# EAGLE board csa_cpu816-v2.0c (EAGLE 4.15)
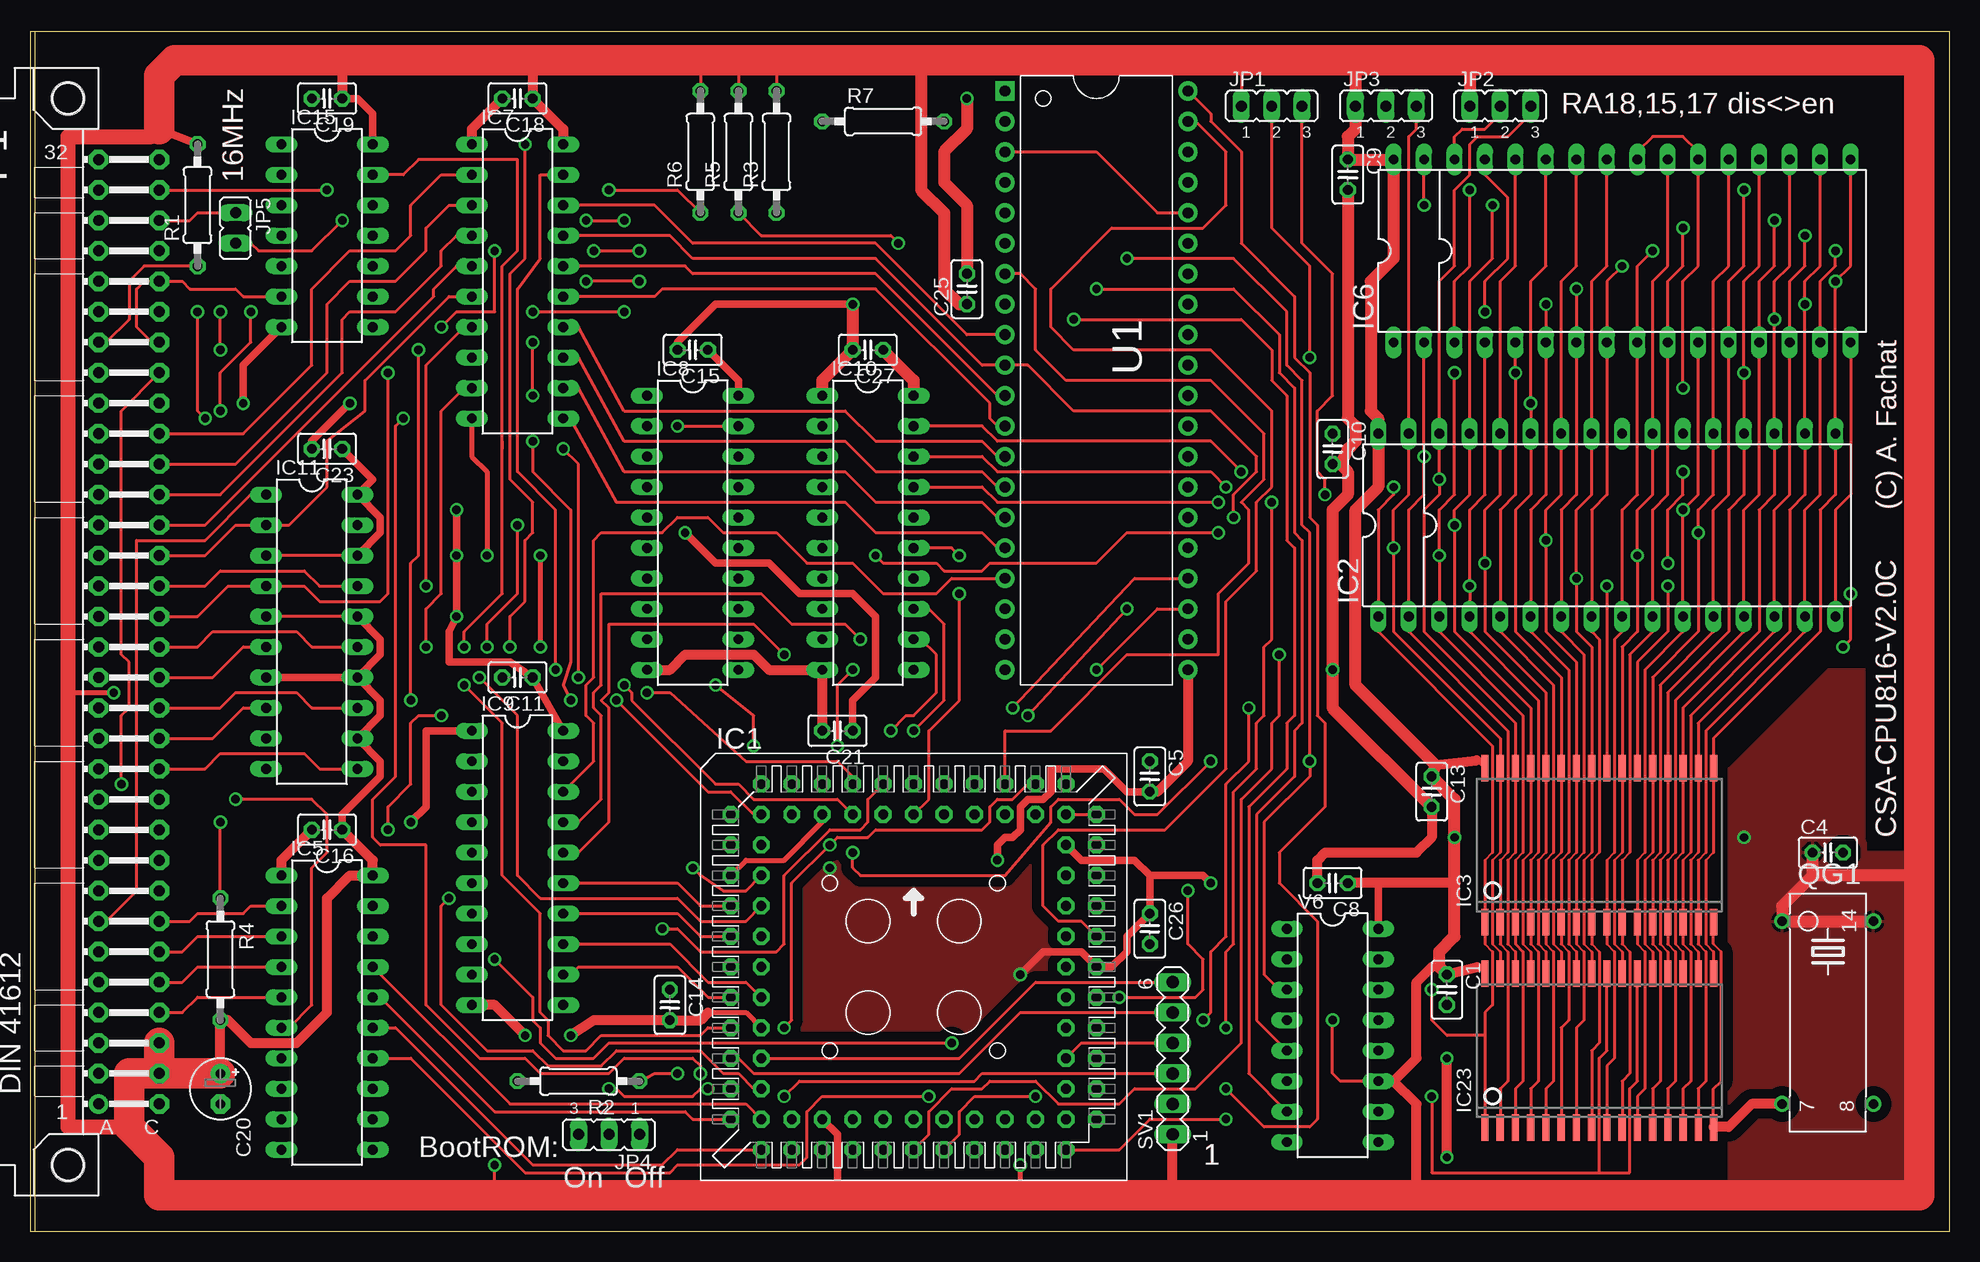
[diagram p2: board, top side]
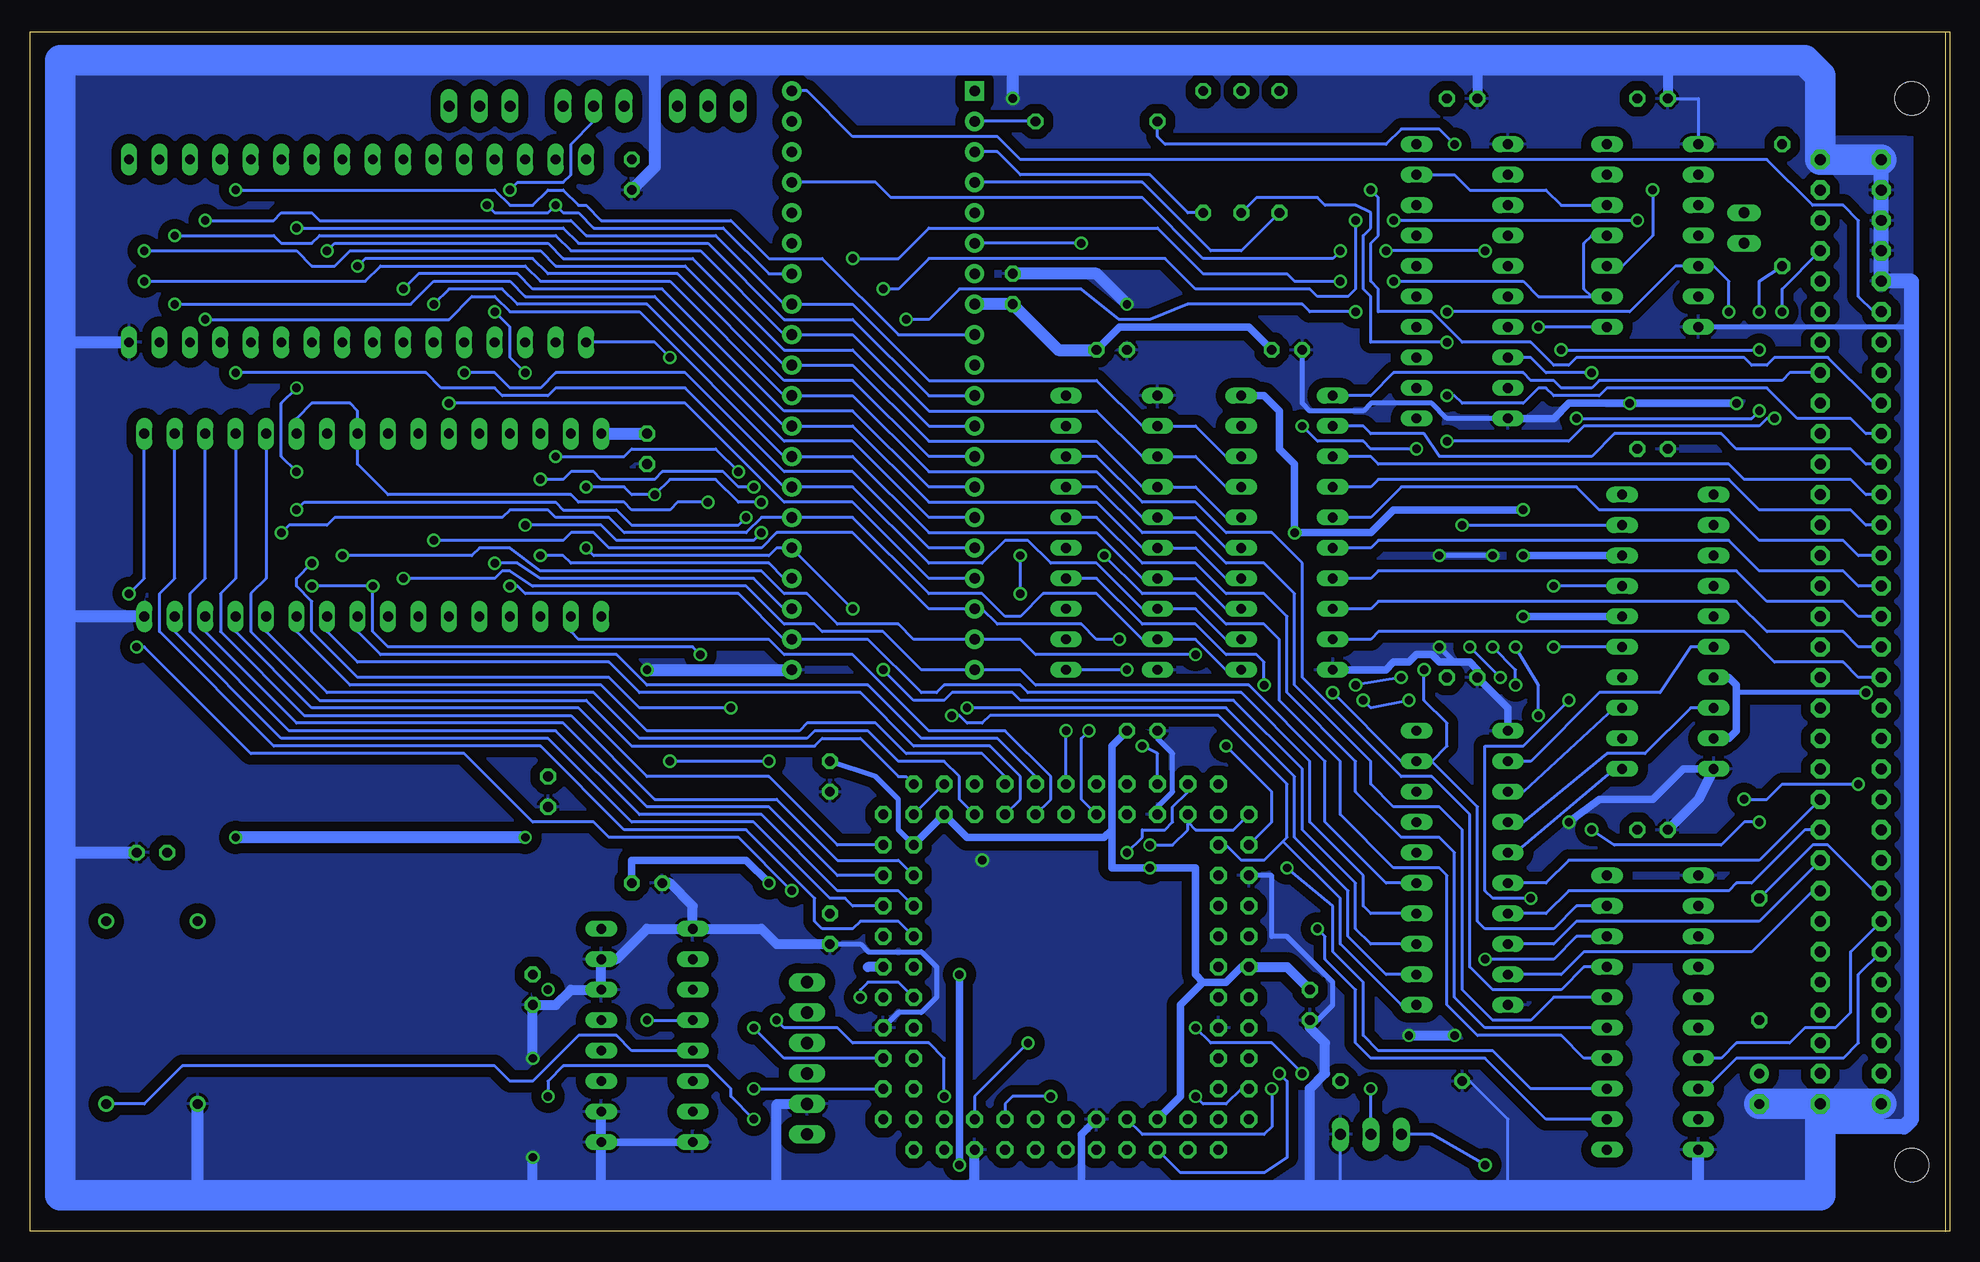
[diagram p3: board, bottom side, seen from below]

Size 160 x 100.03 mm. Coordinates in mm from the lower left corner, seen from the top.
Outline: 0,0.01 160,0.01 160,100.01 0,100.01 0,0.01
Copper layers (1*16): Top 0.035mm / dielectric 1.5mm / Bottom 0.035mm
Design rules "default": minimum track width 7mil, minimum drill 24mil, track to track 6mil, track to pad 8mil, pad to pad 8mil, via to via 8mil, smd to smd 8mil, copper to edge 40mil, drill to drill 8mil, minimum pad ring 10mil, minimum via ring 8mil, stop-mask expansion 4mil, vias tented up to drill 0mil, thermal gap 10mil

## Footprints (pad centres in the part's own frame; a part is rotated, then mirrored left to right if it is on the bottom)
C025-025X050 = drill 0.813 octagon: 1 -1.27,0; 2 1.27,0
E2,5-5 = drill 0.813 pad 1.6 round: + -1.27,0 | drill 0.813 pad 1.6 octagon: - 1.27,0
PLCC-S84 = drill 0.813 pad 1.397 octagon: 1 0,15.24; 2 0,12.7; 3 -2.54,15.24; 4 -2.54,12.7; 5 -5.08,15.24; 6 -5.08,12.7; 7 -7.62,15.24; 8 -7.62,12.7; 9 -10.16,15.24; 10 -10.16,12.7; 11 -12.7,15.24; 12 -15.24,12.7; 13 -12.7,12.7; 14 -15.24,10.16; 15 -12.7,10.16; 16 -15.24,7.62; 17 -12.7,7.62; 18 -15.24,5.08; 19 -12.7,5.08; 20 -15.24,2.54; 21 -12.7,2.54; 22 -15.24,0; 23 -12.7,0; 24 -15.24,-2.54; 25 -12.7,-2.54; 26 -15.24,-5.08; 27 -12.7,-5.08; 28 -15.24,-7.62; 29 -12.7,-7.62; 30 -15.24,-10.16; 31 -12.7,-10.16; 32 -15.24,-12.7; 33 -12.7,-15.24; 34 -12.7,-12.7; 35 -10.16,-15.24; 36 -10.16,-12.7; 37 -7.62,-15.24; 38 -7.62,-12.7; 39 -5.08,-15.24; 40 -5.08,-12.7; 41 -2.54,-15.24; 42 -2.54,-12.7; 43 0,-15.24; 44 0,-12.7; 45 2.54,-15.24; 46 2.54,-12.7; 47 5.08,-15.24; 48 5.08,-12.7; 49 7.62,-15.24; 50 7.62,-12.7; 51 10.16,-15.24; 52 10.16,-12.7; 53 12.7,-15.24; 54 15.24,-12.7; 55 12.7,-12.7; 56 15.24,-10.16; 57 12.7,-10.16; 58 15.24,-7.62; 59 12.7,-7.62; 60 15.24,-5.08; 61 12.7,-5.08; 62 15.24,-2.54; 63 12.7,-2.54; 64 15.24,0; 65 12.7,0; 66 15.24,2.54; 67 12.7,2.54; 68 15.24,5.08; 69 12.7,5.08; 70 15.24,7.62; 71 12.7,7.62; 72 15.24,10.16; 73 12.7,10.16; 74 15.24,12.7; 75 12.7,15.24; 76 12.7,12.7; 77 10.16,15.24; 78 10.16,12.7; 79 7.62,15.24; 80 7.62,12.7; 81 5.08,15.24; 82 5.08,12.7; 83 2.54,15.24; 84 2.54,12.7
DIL32OPT28 = drill 0.813 long: 1 -19.05,-7.62; 2 -16.51,-7.62; 3 -13.97,-7.62; 4 -11.43,-7.62; 5 -8.89,-7.62; 6 -6.35,-7.62; 7 -3.81,-7.62; 8 -1.27,-7.62; 9 1.27,-7.62; 10 3.81,-7.62; 11 6.35,-7.62; 12 8.89,-7.62; 13 11.43,-7.62; 14 13.97,-7.62; 15 16.51,-7.62; 16 19.05,-7.62; 17 19.05,7.62; 18 16.51,7.62; 19 13.97,7.62; 20 11.43,7.62; 21 8.89,7.62; 22 6.35,7.62; 23 3.81,7.62; 24 1.27,7.62; 25 -1.27,7.62; 26 -3.81,7.62; 27 -6.35,7.62; 28 -8.89,7.62; 29 -11.43,7.62; 30 -13.97,7.62; 31 -16.51,7.62; 32 -19.05,7.62
SOP32 = smd 0.6 x 2.2: 1 -8.89,-6.416; 2 -7.62,-6.416; 3 -6.35,-6.416; 4 -5.08,-6.416; 5 -3.81,-6.416; 6 -2.54,-6.416; 7 -1.27,-6.416; 8 0,-6.416; 9 1.27,-6.416; 10 2.54,-6.416; 11 3.81,-6.416; 12 5.08,-6.416; 13 6.35,-6.416; 14 7.62,-6.416; 15 8.89,-6.416; 16 10.16,-6.416; 17 10.16,6.416; 18 8.89,6.416; 19 7.62,6.416; 20 6.35,6.416; 21 5.08,6.416; 22 3.81,6.416; 23 2.54,6.416; 24 1.27,6.416; 25 0,6.416; 26 -1.27,6.416; 27 -2.54,6.416; 28 -3.81,6.416; 29 -5.08,6.416; 30 -6.35,6.416; 31 -7.62,6.416; 32 -8.89,6.416
DIL20 = drill 0.813 long: 1 -11.43,-3.81; 2 -8.89,-3.81; 3 -6.35,-3.81; 4 -3.81,-3.81; 5 -1.27,-3.81; 6 1.27,-3.81; 7 3.81,-3.81; 8 6.35,-3.81; 9 8.89,-3.81; 10 11.43,-3.81; 11 11.43,3.81; 12 8.89,3.81; 13 6.35,3.81; 14 3.81,3.81; 15 1.27,3.81; 16 -1.27,3.81; 17 -3.81,3.81; 18 -6.35,3.81; 19 -8.89,3.81; 20 -11.43,3.81
DIL20' = drill 0.813 long: 1 -10.16,-3.81; 2 -7.62,-3.81; 3 -5.08,-3.81; 4 -2.54,-3.81; 5 0,-3.81; 6 2.54,-3.81; 7 5.08,-3.81; 8 7.62,-3.81; 9 10.16,-3.81; 10 12.7,-3.81; 11 12.7,3.81; 12 10.16,3.81; 13 7.62,3.81; 14 5.08,3.81; 15 2.54,3.81; 16 0,3.81; 17 -2.54,3.81; 18 -5.08,3.81; 19 -7.62,3.81; 20 -10.16,3.81
DIL14 = drill 0.813 long: 1 -7.62,-3.81; 2 -5.08,-3.81; 3 -2.54,-3.81; 4 0,-3.81; 5 2.54,-3.81; 6 5.08,-3.81; 7 7.62,-3.81; 8 7.62,3.81; 9 5.08,3.81; 10 2.54,3.81; 11 0,3.81; 12 -2.54,3.81; 13 -5.08,3.81; 14 -7.62,3.81
JP2 = drill 0.914 long: 1 -2.54,0; 2 0,0; 3 2.54,0
JP1 = drill 0.914 long: 1 0,-1.27; 2 0,1.27
CSABUS = drill 0.914 pad 1.6 round: A1 7.62,36.83 | drill 0.914 pad 1.6 octagon: A2 7.62,34.29; A3 7.62,31.75; A4 7.62,29.21; A5 7.62,26.67; A6 7.62,24.13; A7 7.62,21.59; A8 7.62,19.05; A9 7.62,16.51; A10 7.62,13.97; A11 7.62,11.43; A12 7.62,8.89; A13 7.62,6.35; A14 7.62,3.81; A15 7.62,1.27; A16 7.62,-1.27; A17 7.62,-3.81; A18 7.62,-6.35; A19 7.62,-8.89; A20 7.62,-11.43; A21 7.62,-13.97; A22 7.62,-16.51; A23 7.62,-19.05; A24 7.62,-21.59; A25 7.62,-24.13; A26 7.62,-26.67; A27 7.62,-29.21; A28 7.62,-31.75; A29 7.62,-34.29; A30 7.62,-36.83; A31 7.62,-39.37; A32 7.62,-41.91; C1 2.54,36.83; C2 2.54,34.29; C3 2.54,31.75; C4 2.54,29.21; C5 2.54,26.67; C6 2.54,24.13; C7 2.54,21.59; C8 2.54,19.05; C9 2.54,16.51; C10 2.54,13.97; C11 2.54,11.43; C12 2.54,8.89; C13 2.54,6.35; C14 2.54,3.81; C15 2.54,1.27; C16 2.54,-1.27; C17 2.54,-3.81; C18 2.54,-6.35; C19 2.54,-8.89; C20 2.54,-11.43; C21 2.54,-13.97; C22 2.54,-16.51; C23 2.54,-19.05; C24 2.54,-21.59; C25 2.54,-24.13; C26 2.54,-26.67; C27 2.54,-29.21; C28 2.54,-31.75; C29 2.54,-34.29; C30 2.54,-36.83; C31 2.54,-39.37; C32 2.54,-41.91 | hole 2.794: 10.16,41.91; 10.16,-46.99
SG51 = drill 0.813 round: 1 -7.62,-3.81; 7 7.62,-3.81; 8 7.62,3.81; 14 -7.62,3.81
0207/10 = drill 0.813 octagon: 1 -5.08,0; 2 5.08,0
MA06-1 = drill 1.016 long: 1 -6.35,0; 2 -3.81,0; 3 -1.27,0; 4 1.27,0; 5 3.81,0; 6 6.35,0
DIP-40 = drill 0.889 pad 1.6 square: 1 -22.86,-7.62 | drill 0.889 pad 1.6 round: 2 -20.32,-7.62; 3 -17.78,-7.62; 4 -15.24,-7.62; 5 -12.7,-7.62; 6 -10.16,-7.62; 7 -7.62,-7.62; 8 -5.08,-7.62; 9 -2.54,-7.62; 10 0,-7.62; 11 2.54,-7.62; 12 5.08,-7.62; 13 7.62,-7.62; 14 10.16,-7.62; 15 12.7,-7.62; 16 15.24,-7.62; 17 17.78,-7.62; 18 20.32,-7.62; 19 22.86,-7.62; 20 25.4,-7.62; 21 25.4,7.62; 22 22.86,7.62; 23 20.32,7.62; 24 17.78,7.62; 25 15.24,7.62; 26 12.7,7.62; 27 10.16,7.62; 28 7.62,7.62; 29 5.08,7.62; 30 2.54,7.62; 31 0,7.62; 32 -2.54,7.62; 33 -5.08,7.62; 34 -7.62,7.62; 35 -10.16,7.62; 36 -12.7,7.62; 37 -15.24,7.62; 38 -17.78,7.62; 39 -20.32,7.62; 40 -22.86,7.62
DIL16 = drill 0.813 long: 1 -8.89,-3.81; 2 -6.35,-3.81; 3 -3.81,-3.81; 4 -1.27,-3.81; 5 1.27,-3.81; 6 3.81,-3.81; 7 6.35,-3.81; 8 8.89,-3.81; 9 8.89,3.81; 10 6.35,3.81; 11 3.81,3.81; 12 1.27,3.81; 13 -1.27,3.81; 14 -3.81,3.81; 15 -6.35,3.81; 16 -8.89,3.81

## Placement (x,y rotation side)
C1  [C025-025X050]  118.1,20.17 270 top
C4  [C025-025X050]  149.85,31.6 0 top
C5  [C025-025X050]  93.34,37.95 270 top
C8  [C025-025X050]  108.58,29.06 180 top
C9  [C025-025X050]  109.85,88.11 270 top
C10  [C025-025X050]  108.58,65.25 270 top
C11  [C025-025X050]  40.64,46.2 180 top
C13  [C025-025X050]  116.83,36.68 270 top
C14  [C025-025X050]  53.34,18.9 270 top
C15  [C025-025X050]  55.24,73.51 180 top
C16  [C025-025X050]  24.76,33.5 180 top
C18  [C025-025X050]  40.64,94.46 180 top
C19  [C025-025X050]  24.76,94.46 180 top
C20  [E2,5-5]  15.87,11.91 270 top
C21  [C025-025X050]  67.3,41.76 180 top
C23  [C025-025X050]  24.76,65.25 180 top
C25  [C025-025X050]  78.1,78.59 90 top
C26  [C025-025X050]  93.34,25.25 270 top
C27  [C025-025X050]  69.84,73.51 180 top
IC1  [PLCC-S84]  73.66,22.07 0 top
IC2  RAMSOCK32TO512K  [DIL32OPT28]  131.44,58.9 0 top
IC3  RAMSOCK32TO512KSOP  [SOP32]  130.17,32.23 0 top
IC5  74HCT245N  [DIL20]  24.76,18.26 270 top
IC6  ROMSOCK32TO512K  [DIL32OPT28]  132.71,81.76 0 top
IC7  74HCT245N  [DIL20]  40.64,79.22 270 top
IC8  74HCT245N  [DIL20]  55.24,58.27 270 top
IC9  74HCT245N  [DIL20]  40.64,30.33 270 top
IC10  74HCT573N  [DIL20]  69.84,58.27 270 top
IC11  74LS688BUSOPT  [DIL20']  23.49,51.28 270 top
IC15  74HCT14N  [DIL14]  24.76,83.03 270 top
IC23  RAMSOCK32TO512KSOP  [SOP32]  130.17,15.09 0 top
JP1  [JP2]  103.5,93.83 0 top
JP2  [JP2]  122.55,93.83 0 top
JP3  [JP2]  113.02,93.83 0 top
JP4  [JP2]  48.26,8.1 180 top
JP5  [JP1]  17.14,83.67 180 top
P1  CSABUS  [CSABUS]  13.33,47.47 180 top
QG1  16MHz  [SG51]  149.85,18.26 270 top
R1  4k7  [0207/10]  13.97,85.57 90 top
R2  4k7  [0207/10]  45.72,12.55 180 top
R3  10k  [0207/10]  62.23,90.02 90 top
R4  4k7  [0207/10]  15.87,22.71 270 top
R5  4k7  [0207/10]  59.05,90.02 90 top
R6  4k7  [0207/10]  55.88,90.02 90 top
R7  470  [0207/10]  71.11,92.56 0 top
SV1  [MA06-1]  95.24,14.45 90 top
U1  [DIP-40]  88.89,72.24 270 top
V6  74193N  [DIL16]  108.58,16.36 270 top

## Tracks (layer width: path | path; a pad name or v marks a point on that pad's centre or on a via)
2PHI2  (via drill 0.7)
  Top 0.254: IC1.13 60.32,34.77 58.41,36.68 56.51,36.68 v48.89,44.3 | v45.08,44.3 44.45,45.57 45.08,47.47 45.08,60.17 41.91,63.35 v41.91,65.89 | v13.97,76.68 13.97,68.43 v14.6,67.79
  Bottom 0.254: v45.08,44.3 48.26,43.66 v48.89,44.3 | P1.C29 13.97,78.59 v13.97,76.68 | v14.6,67.79 15.24,67.79 15.87,67.16 30.47,67.16 31.74,65.89 v41.91,65.89
16M  (via drill 0.7)
  Top 0.254: JP5.2 18.41,82.4 19.04,81.76 23.49,81.76 v26.03,84.3 | V6.5 102.23,17.63 102.23,34.77 105.41,37.95 105.41,41.76 106.04,42.39 106.04,57.63 105.41,58.27 105.41,70.33 104.13,71.6 104.13,74.78 100.32,78.59 v88.89,78.59 | v46.35,84.3 v49.53,84.3
  Bottom 0.254: QG1.8 150.49,10.64 147.31,13.82 121.28,13.82 120.01,12.55 118.1,12.55 114.3,16.36 111.12,16.36 109.85,15.09 V6.5 | v88.89,78.59 87.62,78.59 85.08,81.13 65.4,81.13 62.86,78.59 53.34,78.59 52.7,77.95 50.16,77.95 49.53,78.59 v49.53,84.3 | v26.03,84.3 v46.35,84.3
/BIOSEL
  Top 0.254: P1.A7 6.34,25.88 8.89,28.42 8.89,57.63 14.6,57.63 18.41,61.44 IC11.1
  Bottom 0.254: P1.A7 8.25,23.34 8.25,18.26 9.52,16.99 12.06,16.99 13.33,15.72 17.77,15.72 19.04,14.45 IC5.7
/BIRQ  (via drill 0.7)
  Top 0.254: v48.26,86.84 53.97,86.84 R6.1
  Bottom 0.254: U1.4 67.3,87.48 61.59,81.76 59.05,81.76 R6.1 | P1.A24 6.34,69.06 10.16,72.87 14.6,72.87 15.24,72.24 16.5,72.24 17.14,72.87 31.11,72.87 31.74,72.24 33.02,72.24 34.92,74.14 40.64,74.14 43.18,76.68 47.62,76.68 47.62,78.59 48.26,79.22 48.26,82.4 47.62,83.03 47.62,86.21 v48.26,86.84
/BMEMSEL
  Bottom 0.254: P1.A6 7.62,21.44 7.62,15.72 8.89,14.45 17.77,14.45 20.31,11.91 IC5.8
/BNMI  (via drill 0.7)
  Top 0.254: v72.38,82.4 71.75,83.03 60.96,83.03 R5.1 | v41.91,69.7 v41.91,74.14
  Bottom 0.254: v72.38,82.4 U1.6 | P1.A23 6.98,66.52 8.25,67.79 12.7,67.79 15.24,70.33 28.57,70.33 29.2,69.7 33.02,69.7 33.65,70.33 34.29,70.33 35.55,69.06 40.64,69.06 41.27,69.7 v41.91,69.7 | v41.91,74.14 48.26,74.14 48.26,77.95 48.89,78.59 48.89,83.03 48.26,83.67 48.26,84.94 49.53,85.57 52.07,85.57 52.7,86.21 57.78,86.21 R5.1
/IOSEL  (via drill 0.7)
  Top 0.254: v55.24,30.33 55.88,29.69 57.78,28.42 59.69,28.42 IC1.17
  Bottom 0.254: IC5.13 34.92,11.91 38.1,15.09 47.62,15.09 48.89,16.36 48.89,20.8 51.43,23.34 51.43,27.15 v55.24,30.33
/MEMSEL  (via drill 0.7)
  Top 0.254: v52.7,25.25 53.97,25.25 55.88,23.34 62.23,23.34 62.86,23.98 62.86,29.69 66.67,33.5 69.21,33.5 69.84,34.14 69.84,36.04 IC1.3
  Bottom 0.254: IC5.12 33.65,9.37 38.73,14.45 48.26,14.45 49.53,15.72 49.53,20.17 52.07,22.71 52.07,24.61 v52.7,25.25
/RAMCS0  (via drill 0.7)
  Top 0.254: v103.5,60.81 103.5,49.38 102.86,48.74 102.86,43.03 102.23,42.39 102.23,38.58 100.32,36.68 100.32,23.98 99.69,23.34 v99.69,16.99
  Bottom 0.254: IC2.22 137.79,67.79 136.52,69.06 133.34,69.06 132.71,68.43 IC2.24 132.71,63.98 130.17,61.44 114.93,61.44 114.3,60.81 110.48,60.81 109.85,60.17 106.67,60.17 106.04,60.81 v103.5,60.81 | v99.69,16.99 97.15,14.45 IC1.58
/RAMCS1  (via drill 0.7)
  Top 0.254: v131.44,53.82 IC3.24 | v136.52,53.82 136.52,50.01 133.98,47.47 IC3.22 133.98,38.58 | v104.13,48.11 104.13,43.03 103.5,42.39 103.5,38.58 100.96,36.04 100.96,15.72 97.15,11.91 92.07,11.91 90.8,10.64 85.72,10.64 83.81,12.55 80,12.55 79.37,11.91 76.83,11.91 74.92,10.01 74.92,8.1 IC1.43
  Bottom 0.254: v136.52,53.82 v131.44,53.82 131.44,50.01 130.17,48.74 104.77,48.74 v104.13,48.11
/RAMCS2  (via drill 0.7)
  Top 0.254: IC23.24 131.44,15.09 130.81,14.45 130.81,4.93 | 130.81,4.93 133.34,4.93 133.34,11.91 133.98,12.55 IC23.22 | 130.81,4.93 116.83,4.93 v116.83,11.28 | v99.69,9.37 93.34,9.37 90.8,6.83 IC1.53
  Bottom 0.254: v116.83,11.28 116.83,12.55 115.56,13.82 103.5,13.82 101.59,11.91 101.59,11.28 v99.69,9.37
/REGSEL  (via drill 0.7)
  Top 0.254: IC1.26 56.51,16.99 55.88,16.36 47.62,16.36 46.35,15.09 44.45,15.09 43.18,16.36 43.18,17.63 42.54,18.26 42.54,26.52 39.37,29.69 39.37,42.39 v36.19,45.57 | v38.1,48.74 38.1,50.65 40.64,53.19 v40.64,58.9
  Bottom 0.254: v36.19,45.57 36.19,46.84 v38.1,48.74 | v40.64,58.9 IC11.19
/RES  (via drill 0.7)
  Top 0.254: U1.40 98.42,93.19 98.42,92.56 100.96,90.02 100.96,82.4 105.41,77.95 105.41,72.87 106.67,71.6 106.67,59.54 107.31,58.9 107.31,43.03 107.94,42.39 107.94,35.41 104.13,31.6 104.13,29.06 107.31,25.88 107.31,9.37 106.67,8.74 102.86,8.74 v99.69,11.91
  Bottom 0.254: U1.40 95.24,95.1 91.44,91.29 79.37,91.29 77.46,89.38 15.24,89.38 11.43,85.57 8.89,85.57 7.62,84.3 7.62,77.95 6.34,76.68 P1.A27 | v99.69,11.91 IC1.56
/ROMCS  (via drill 0.7)
  Top 0.254: IC6.24 133.98,90.02 135.25,91.29 137.79,91.29 139.06,90.02 IC6.22 139.06,80.49 137.79,79.22 v137.79,70.33 | v137.79,63.35 137.79,61.44 136.52,60.17 v136.52,55.73 | v101.59,43.66 101.59,39.22 99.69,37.31 99.69,24.61 98.42,23.34 98.42,18.26 v97.78,17.63 | IC1.45 77.46,8.1 77.46,10.01 78.73,11.28 v83.81,11.28
  Bottom 0.254: v137.79,70.33 139.06,69.06 139.06,64.62 v137.79,63.35 | v136.52,55.73 137.79,54.46 137.79,53.82 136.52,52.55 136.52,50.01 132.71,46.2 111.75,46.2 109.21,43.66 v101.59,43.66 | v83.81,11.28 83.81,14.45 85.08,15.72 91.44,15.72 92.7,16.99 97.15,16.99 v97.78,17.63
BA0
  Top 0.254: P1.C23 17.77,66.52 23.49,72.24 23.49,78.59 26.66,81.76 30.47,81.76 31.74,83.03 31.74,85.57 34.29,88.11 IC7.2
BA1
  Top 0.254: P1.C22 17.14,63.98 24.76,71.6 24.76,77.32 26.66,79.22 30.47,79.22 33.02,81.76 33.02,83.67 34.92,85.57 IC7.3
BA2
  Top 0.254: P1.C21 15.87,61.44 26.03,71.6 26.03,76.05 26.66,76.68 30.47,76.68 34.29,80.49 34.29,81.76 35.55,83.03 IC7.4
BA3
  Top 0.254: P1.C20 14.6,58.9 33.65,77.95 33.65,78.59 35.55,80.49 IC7.5
BA4
  Top 0.254: P1.C19 14.6,56.36 17.14,58.9 IC11.2 21.58,58.9 24.76,62.08 24.76,65.89 27.93,68.43 27.93,70.97 34.92,77.95 IC7.6
BA5  (via drill 0.7)
  Top 0.254: P1.C18 14.6,53.82 15.87,55.09 22.86,55.09 24.12,53.82 IC11.17 | v33.02,53.82 33.02,72.24 36.19,75.41 IC7.7
  Bottom 0.254: IC11.17 v33.02,53.82
BA6  (via drill 0.7)
  Top 0.254: P1.C17 13.97,51.28 16.5,53.82 IC11.4 22.86,53.82 24.12,52.55 29.2,52.55 29.84,53.19 v29.84,71.6
  Bottom 0.254: v29.84,71.6 33.65,71.6 34.92,72.87 IC7.8
BA7  (via drill 0.7)
  Top 0.254: P1.C16 13.97,48.74 15.24,50.01 22.22,50.01 23.49,48.74 IC11.15 | v33.02,48.74 33.02,51.92 34.29,53.19 34.29,68.43 36.19,70.33 IC7.9
  Bottom 0.254: IC11.15 v33.02,48.74
BA8
  Top 0.254: P1.C15 15.24,46.2 17.77,48.74 IC11.6
  Bottom 0.254: IC11.6 21.58,48.74 24.12,44.93 29.2,44.93 34.92,39.22 IC9.2
BA9
  Top 0.254: P1.C14 15.87,43.66 17.14,44.93 22.22,44.93 23.49,43.66 IC11.13
  Bottom 0.254: IC11.13 27.93,43.66 35.55,36.68 IC9.3
BA10
  Top 0.254: P1.C13 15.24,41.12 17.77,43.66 IC11.8
  Bottom 0.254: IC11.8 21.58,43.66 25.39,39.85 28.57,39.85 35.55,34.14 IC9.4
BA11
  Top 0.254: P1.C12 14.6,38.58 15.87,39.85 22.86,39.85 24.12,38.58 IC11.11
  Bottom 0.254: IC11.11 27.93,38.58 36.19,31.6 IC9.5
BA12
  Bottom 0.254: P1.C11 15.87,30.96 31.74,30.96 33.65,29.06 IC9.6
BA13
  Bottom 0.254: P1.C10 12.06,33.5 16.5,29.06 17.77,29.06 18.41,28.42 31.74,28.42 33.65,26.52 IC9.7
BA14
  Bottom 0.254: P1.C9 15.87,25.88 31.11,25.88 33.02,23.98 IC9.8
BA15
  Bottom 0.254: P1.C8 11.43,28.42 16.5,23.34 30.47,23.34 32.38,21.44 IC9.9
BA16
  Top 0.254: P1.C7 13.33,25.88 13.97,26.52 17.77,26.52 18.41,27.15 IC5.2
BA17
  Top 0.254: P1.C6 12.7,23.34 13.97,24.61 IC5.3
BA18
  Top 0.254: P1.C5 12.7,20.8 13.97,22.07 IC5.4
BA19
  Top 0.254: P1.C4 12.7,18.26 13.97,19.53 IC5.5
BD0
  Bottom 0.254: P1.A22 6.98,63.98 8.25,65.25 17.77,65.25 19.04,66.52 27.93,66.52 29.84,64.62 42.54,64.62 43.81,66.52 48.26,66.52 48.89,67.16 IC8.2
BD1
  Bottom 0.254: P1.A21 6.98,61.44 8.25,62.71 17.14,62.71 18.41,63.98 47.62,63.98 48.26,64.62 IC8.3
BD2
  Bottom 0.254: P1.A20 6.98,58.9 8.25,60.17 15.87,60.17 18.41,62.71 47.62,62.71 48.26,62.08 IC8.4
BD3
  Bottom 0.254: P1.A19 7.62,56.36 8.89,57.63 15.87,57.63 18.41,60.17 29.2,60.17 31.11,62.08 45.72,62.08 48.26,59.54 IC8.5
BD4
  Bottom 0.254: P1.A18 7.62,53.82 8.89,55.09 15.87,55.09 18.41,57.63 47.62,57.63 48.26,57 IC8.6
BD5
  Bottom 0.254: P1.A17 7.62,51.28 8.89,52.55 15.24,52.55 17.77,55.09 47.62,55.09 48.26,54.46 IC8.7
BD6
  Bottom 0.254: P1.A16 7.62,48.74 8.89,50.01 15.24,50.01 17.77,52.55 47.62,52.55 48.26,51.92 IC8.8
BD7
  Bottom 0.254: P1.A15 7.62,46.2 8.89,47.47 14.6,47.47 17.14,50.01 47.62,50.01 48.26,49.38 IC8.9
BE  (via drill 0.7)
  Top 0.254: IC7.19 42.54,88.11 42.54,81.13 40.64,78.59 40.64,63.35 43.81,60.17 v43.81,46.84 | IC1.5 68.57,37.95 67.3,39.22 59.69,39.22 53.34,44.93 v51.43,44.93
  Bottom 0.254: IC5.19 31.11,27.15 33.02,25.25 38.73,25.25 39.37,25.88 39.37,35.41 43.18,39.22 | 43.18,39.22 IC9.19 45.72,39.22 v51.43,44.93 | IC15.12 32.38,85.57 33.65,86.84 40,86.84 41.27,88.11 IC7.19 | v43.81,46.84 43.81,44.3 41.91,42.39 41.91,40.49 43.18,39.22
BOOTROMIN  (via drill 0.7)
  Top 0.254: v48.26,11.91 48.89,11.91 49.53,11.28 55.24,11.28 55.88,11.91 v56.51,11.91
  Bottom 0.254: IC1.40 67.3,8.1 57.15,8.1 56.51,8.74 v56.51,11.91 | JP4.2 v48.26,11.91
BR/-W  (via drill 0.7)
  Top 0.254: IC5.6 21.58,16.99 23.49,18.9 23.49,30.33 24.76,31.6 24.76,34.77 23.49,36.04 v17.14,36.04 | v7.62,37.31 7.62,43.03 8.25,43.66 8.25,47.47 7.62,48.11 7.62,68.43 P1.C25
  Bottom 0.254: v17.14,36.04 15.24,36.04 13.97,37.31 v7.62,37.31 | P1.C25 13.33,71.6 13.97,70.97 29.2,70.97 29.84,70.33 32.38,70.33 33.02,70.97 34.92,70.97 35.55,71.6 46.35,71.6 48.26,69.7 IC8.1
BRDY  (via drill 0.7)
  Top 0.254: P1.A26 6.34,74.14 8.25,76.05 8.25,79.22 9.52,80.49 R1.1 | v15.87,73.51 v15.87,76.68 | v32.38,73.51 32.38,56.36 31.74,55.73 v31.74,44.3 | v34.92,27.79 34.29,27.15 34.29,18.9 38.1,15.09 41.91,15.09 43.18,13.82 47.62,13.82 48.89,15.09 55.88,15.09 57.78,13.18 59.05,13.18 60.32,11.91 IC1.31
  Bottom 0.254: v15.87,76.68 15.87,79.22 R1.1 | v32.38,73.51 v15.87,73.51 | v31.74,44.3 35.55,40.49 38.73,40.49 38.73,28.42 38.1,27.79 v34.92,27.79
BUS16M
  Top 0.254: P1.C30 13.33,84.3 13.97,84.94 JP5.1
C8PHI2  (via drill 0.7)
  Top 0.254: V6.3 104.13,20.17 102.86,21.44 102.86,34.14 106.67,37.95 v106.67,39.22 106.67,58.27 106.04,58.9 106.04,70.97 104.77,72.24 104.77,76.68 100.32,81.13 v91.44,81.13 | v50.8,79.22 v46.35,79.22 | v68.57,31.6 68.57,30.33 69.21,29.69 81.27,29.69 85.08,34.14 85.08,35.41 85.72,36.04 90.8,36.04 92.07,34.77 93.97,34.77 v98.42,39.22
  Bottom 0.254: v91.44,81.13 87.62,81.13 85.08,83.67 66.03,83.67 62.23,79.86 55.24,79.86 54.61,79.22 v50.8,79.22 | IC15.11 29.84,83.03 30.47,82.4 30.47,78.59 29.84,77.95 IC15.9 34.29,77.95 35.55,79.22 v46.35,79.22 | IC1.9 63.5,36.68 64.77,35.41 64.77,34.14 65.4,33.5 67.3,33.5 67.3,32.87 v68.57,31.6 | v98.42,39.22 v106.67,39.22
CPURDY  (via drill 0.7)
  Top 0.254: v41.27,90.65 41.27,81.13 40,79.86 40,62.71 41.91,60.81 41.91,58.27 41.27,57.63 41.27,52.55 40,51.28 v40,48.74 | v37.46,46.2 40.64,43.03 40.64,29.69 42.54,27.79 53.97,27.79 55.88,25.88 59.69,25.88 IC1.19
  Bottom 0.254: v41.27,90.65 42.54,91.92 45.72,91.92 46.98,90.65 65.4,90.65 66.03,91.29 R7.1 | v37.46,46.2 v40,48.74
CPUVDA
  Top 0.254: U1.39 97.15,92.56 99.69,90.02 99.69,85.57 97.78,83.67 90.16,83.67 85.08,78.59 85.08,75.41 86.99,73.51 98.42,73.51 103.5,68.43 103.5,62.08 102.23,60.81 102.23,55.09 99.69,52.55 99.69,38.58 94.61,33.5 85.72,33.5 84.45,32.23 84.45,27.15 85.72,25.88 87.62,25.88 IC1.66
CPUVPA
  Top 0.254: U1.7 82.55,79.86 83.81,78.59 83.81,73.51 86.35,70.97 98.42,70.97 102.86,66.52 102.86,62.71 100.96,60.81 101.59,60.17 101.59,55.73 99.05,53.19 99.05,48.11 91.44,48.11 85.08,41.76 81.27,41.76 IC1.79
GND  (via drill 0.7)
  Top 0.203: 140.97,23.34 140.33,23.98
  Top 0.254: IC2.16 150.49,60.17 151.76,61.44 IC6.16 | 140.33,23.98 IC3.16 | 140.97,23.34 140.97,12.55 140.33,11.91 140.33,8.74 IC23.16
  Top 0.406: 56.51,18.26 59.69,18.26 IC1.27 | IC1.16 59.69,30.96 62.86,30.96 66.03,34.14 IC1.8 | IC7.10 36.83,64.62 38.1,63.35 v38.1,56.36 | v42.54,56.36 v42.54,48.74
  Top 0.61: v31.74,34.14 33.02,35.41 33.02,41.76 IC9.1 | C23.2 23.49,65.89 v26.66,69.06 | v17.77,69.06 17.77,72.24 IC15.7 | C15.2 53.97,74.14 57.15,77.32 v68.57,77.32 | C5.2 91.44,36.68 89.53,38.58 85.08,38.58 85.08,36.68 84.45,36.04 83.18,36.04 82.55,35.41 82.55,33.5 81.91,32.87 81.27,32.87 80.64,32.23 v80.64,30.96
  Top 0.813: IC5.1 20.95,30.96 C16.2 | v118.1,6.2 v118.1,14.45 | QG1.7 143.5,10.64 141.6,8.74 140.33,8.74 | C8.2 107.31,30.96 107.94,31.6 115.56,31.6 116.83,32.87 C13.2 | IC8.10 53.34,46.84 54.61,48.11 60.32,48.11 61.59,46.84 IC10.10 C21.2 | IC9.10 38.73,18.9 v41.27,16.36 | v45.08,16.36 46.98,17.63 C14.2 55.88,17.63 56.51,18.26 | C5.2 93.97,36.68 96.52,39.22 U1.21 | IC7.1 36.83,91.92 C18.2
  Top 1.016: 109.21,63.98 109.85,65.25 110.48,65.89 110.48,67.16 109.85,67.79 C9.2 | 109.21,63.98 C10.2 | 109.21,63.98 109.85,63.35 109.85,61.44 108.58,60.17 v108.58,46.84 108.58,43.66 C13.2 | C25.2 78.1,85.57 76.19,87.48 76.19,90.02 78.1,91.92 v78.1,94.46 | IC10.1 66.03,70.97 C27.2 v68.57,77.32
  Bottom 0.254: C13.2 116.83,36.04 | 50.8,3.02 JP4.1 | IC15.1 20.95,94.46 C19.2 | R2.2 40,12.55 36.83,9.37 36.83,3.02
  Bottom 0.406: C21.2 66.03,41.12 64.77,39.85 64.77,36.68 66.03,35.41 IC1.8 | IC1.60 87.62,18.26 85.72,18.26 84.45,19.53 84.45,22.07 85.72,23.34 90.16,23.34 90.8,23.98 C26.2 | 3.17,75.41 IC15.7 | IC1.16 56.51,29.69 56.51,24.61 55.24,24.61 51.43,20.8 51.43,18.9 52.7,17.63 C14.2 | 40,47.47 41.27,47.47 v42.54,48.74 | v38.1,56.36 v42.54,56.36 | IC7.10 41.91,67.79 43.18,69.06 48.26,69.06 48.89,68.43 53.34,68.43 53.97,69.06 C15.2
  Bottom 0.61: IC11.10 22.22,38.58 24.76,36.04 29.2,36.04 v31.74,34.14 | IC9.1 36.83,43.66 C11.2 39.37,46.84 40,47.47 42.54,47.47 43.18,48.11 44.45,48.11 45.08,47.47 46.35,47.47 46.98,46.84 IC8.10 | IC1.42 72.38,8.1 72.38,3.02 | v17.77,69.06 v26.66,69.06 31.74,69.06 33.02,67.79 IC7.10 | V6.9 V6.8
  Bottom 0.813: C16.2 20.95,36.04 IC11.10 | 118.1,3.02 v118.1,6.2 | v118.1,14.45 C1.2 116.2,18.9 114.93,20.17 V6.14 V6.15 111.12,22.71 108.58,25.25 V6.1 | 112.39,3.02 V6.9 V6.10 | SV1.2 97.78,10.64 97.78,3.02 | V6.1 104.77,27.15 106.67,29.06 C8.2 | v45.08,16.36 v41.27,16.36 | C26.2 97.78,23.98 99.05,25.25 V6.1 | 81.27,3.02 IC1.49 | 53.34,3.02 53.34,11.91 52.07,13.18 52.07,15.72 53.34,16.99 C14.2 | 23.49,97.64 C19.2 | 39.37,97.64 C18.2
  Bottom 1.016: 20.95,3.02 IC5.10 | C9.2 107.94,88.75 107.94,97.64 | v108.58,46.84 U1.21 | 146.04,3.02 QG1.7 | 157.47,31.6 C4.2 | IC2.16 158.11,51.28 | 157.47,74.14 IC6.16 | 78.1,97.64 v78.1,94.46 | C25.2 71.11,79.86 v68.57,77.32
  Bottom 1.27: P1.A32 P1.A31 P1.A30 P1.A29 P1.A28 3.17,79.22 3.17,75.41 3.17,9.37 3.8,8.74 10.79,8.74
  Bottom 2.54: P1.A32 P1.C32 10.79,96.37 12.06,97.64 23.49,97.64 39.37,97.64 78.1,97.64 107.94,97.64 157.47,97.64 157.47,74.14 157.47,31.6 157.47,3.02 146.04,3.02 118.1,3.02 112.39,3.02 97.78,3.02 81.27,3.02 72.38,3.02 53.34,3.02 50.8,3.02 36.83,3.02 20.95,3.02 10.79,3.02 10.79,8.74 P1.C1 | P1.C1 P1.A1 | P1.C1 11.43,10.64 | P1.C1 C20.-
  pour Bottom (isolate 0.813): 3.17,91.29 3.17,8.74 10.79,8.74 10.79,3.02 156.2,3.02 157.47,3.66 157.47,97 158.11,97.64 10.79,97.64 10.79,91.29
LATCHEN  (via drill 0.7)
  Top 0.254: v68.57,46.84 67.3,45.57 v67.3,40.49
  Bottom 0.254: v68.57,46.84 IC10.11 | v67.3,40.49 66.03,39.85 IC1.7
MA0  (via drill 0.7)
  Top 0.203: 135.88,31.6 135.25,30.96 | 135.25,23.98 135.88,23.34
  Top 0.254: IC3.12 135.25,25.88 | 135.25,30.96 IC3.12 | 135.88,31.6 135.88,45.57 140.33,50.01 IC2.12 140.33,60.17 141.6,61.44 IC6.12 141.6,79.22 142.87,80.49 v142.87,86.84 | IC3.12 135.25,23.98 | 135.88,23.34 135.88,12.55 135.25,11.91 IC23.12 | U1.9 78.1,74.78 70.48,82.4 55.24,82.4 52.07,85.57 IC7.18
  Bottom 0.254: U1.9 87.62,74.78 93.97,81.13 98.42,81.13 101.59,84.3 112.39,84.3 113.66,85.57 114.3,85.57 115.56,86.84 116.83,86.84 118.1,85.57 120.01,85.57 121.28,86.84 v142.87,86.84 | IC2.12 140.33,50.01 135.25,44.93 113.02,44.93 109.21,41.12 95.24,41.12 94.61,41.76 90.16,41.76 87.62,39.22 83.81,39.22 82.55,37.95 82.55,36.04 IC1.80
MA1  (via drill 0.7)
  Top 0.203: 134.62,31.6 133.98,30.96 | 133.98,23.98 134.62,23.34
  Top 0.254: IC3.11 133.98,25.88 | 133.98,30.96 IC3.11 | 134.62,31.6 134.62,46.84 137.79,50.01 IC2.11 v137.79,60.17 139.06,61.44 IC6.11 | IC3.11 133.98,23.98 | 134.62,23.34 134.62,11.91 133.98,11.28 IC23.11 | IC7.17 53.34,83.03 55.24,81.13 70.48,81.13 79.37,72.24 U1.10 83.18,72.24 86.99,68.43 98.42,68.43 102.23,64.62 102.23,63.35 100.32,61.44 v100.32,59.54
  Bottom 0.254: v100.32,59.54 100.96,58.9 109.85,58.9 111.12,60.17 115.56,60.17 116.2,60.81 137.16,60.81 v137.79,60.17 | IC2.11 137.79,50.01 133.34,45.57 112.39,45.57 108.58,41.76 95.88,41.76 95.24,42.39 89.53,42.39 86.99,39.85 80.64,39.85 78.73,37.95 IC1.81
MA2  (via drill 0.7)
  Top 0.203: 133.34,31.6 132.71,30.96 | 132.71,23.98 133.34,23.34
  Top 0.254: IC3.10 132.71,25.88 | 132.71,30.96 IC3.10 | 133.34,31.6 133.34,48.11 135.25,50.01 IC2.10 135.25,60.17 136.52,61.44 IC6.10 136.52,79.22 137.79,80.49 v137.79,83.67 | IC3.10 132.71,23.98 | 133.34,23.34 133.34,13.18 132.71,12.55 IC23.10 | U1.11 80.64,69.7 70.48,79.86 55.24,79.86 54.61,80.49 IC7.16
  Bottom 0.254: U1.11 85.08,69.7 91.44,76.05 97.15,76.05 103.5,82.4 114.3,82.4 115.56,83.67 v137.79,83.67 | IC2.10 135.25,50.01 132.71,47.47 111.75,47.47 109.21,44.93 90.8,44.93 86.35,40.49 80,40.49 77.46,37.95 77.46,36.04 IC1.82
MA3  (via drill 0.7)
  Top 0.203: 132.07,31.6 131.44,30.96 | 131.44,23.98 132.07,23.34
  Top 0.254: IC3.9 131.44,25.88 | 131.44,30.96 IC3.9 | 132.07,31.6 132.07,49.38 132.71,50.01 IC2.9 132.71,60.17 133.98,61.44 IC6.9 133.98,80.49 v135.25,81.76 | IC3.9 131.44,23.98 | 132.07,23.34 132.07,14.45 131.44,13.82 IC23.9 | U1.12 80.64,67.16 80,67.79 80,69.06 70.48,78.59 52.7,78.59 52.07,77.95 IC7.15
  Bottom 0.254: U1.12 85.08,67.16 91.44,73.51 97.15,73.51 104.77,81.13 115.56,81.13 116.83,82.4 134.62,82.4 v135.25,81.76 | IC2.9 132.71,50.01 130.81,48.11 111.12,48.11 108.58,45.57 90.16,45.57 85.72,41.12 79.37,41.12 76.19,37.95 IC1.83
MA4  (via drill 0.7)
  Top 0.203: 130.81,31.6 130.17,30.96 | 130.17,23.98 130.81,23.34
  Top 0.254: IC3.8 130.17,25.88 | 130.17,30.96 IC3.8 | 130.81,31.6 130.81,49.38 130.17,50.01 IC2.8 130.17,60.17 131.44,61.44 IC6.8 131.44,79.22 v132.71,80.49 | IC3.8 130.17,23.98 | 130.81,23.34 130.81,15.72 130.17,15.09 IC23.8 | U1.13 80.64,64.62 79.37,65.89 70.48,65.89 67.94,68.43 49.53,68.43 45.72,75.41 IC7.14
  Bottom 0.254: U1.13 85.08,64.62 91.44,70.97 97.15,70.97 106.04,79.86 116.83,79.86 118.1,81.13 132.07,81.13 v132.71,80.49
MA5  (via drill 0.7)
  Top 0.203: 129.53,31.6 128.9,30.96 | 128.9,23.98 129.53,23.34
  Top 0.254: IC3.7 128.9,25.88 | 128.9,30.96 IC3.7 | 129.53,31.6 129.53,48.11 127.63,50.01 IC2.7 127.63,60.17 128.9,61.44 IC6.7 v128.9,78.59 | IC3.7 128.9,23.98 | 129.53,23.34 129.53,17.63 128.9,16.99 IC23.7 | U1.14 80.64,62.08 79.37,63.35 70.48,63.35 67.94,65.89 49.53,65.89 45.72,72.87 IC7.13
  Bottom 0.254: U1.14 85.08,62.08 91.44,68.43 97.15,68.43 107.31,78.59 118.1,78.59 119.38,79.86 127.63,79.86 v128.9,78.59
MA6  (via drill 0.7)
  Top 0.203: 128.27,31.6 127.63,30.96 | 127.63,23.98 128.27,23.34
  Top 0.254: IC3.6 127.63,25.88 | 127.63,30.96 IC3.6 | 128.27,31.6 128.27,46.84 125.09,50.01 IC2.6 125.09,60.17 126.36,61.44 IC6.6 v126.36,77.32 | IC3.6 127.63,23.98 | 128.27,23.34 128.27,17.63 127.63,16.99 IC23.6 | U1.15 80.64,59.54 79.37,60.81 70.48,60.81 67.94,63.35 49.53,63.35 45.72,70.33 IC7.12
  Bottom 0.254: U1.15 85.08,59.54 91.44,65.89 97.15,65.89 108.58,77.32 119.38,77.32 120.64,78.59 125.09,78.59 v126.36,77.32
MA7  (via drill 0.7)
  Top 0.203: 126.99,31.6 126.36,30.96 | 126.36,23.98 126.99,23.34
  Top 0.254: IC3.5 126.36,25.88 | 126.36,30.96 IC3.5 | 126.99,31.6 126.99,45.57 122.55,50.01 IC2.5 122.55,60.17 123.82,61.44 v123.82,71.6 IC6.5 | IC3.5 126.36,23.98 | 126.99,23.34 126.99,12.55 126.36,11.91 IC23.5 | U1.16 80.64,57 79.37,58.27 70.48,58.27 67.94,60.81 48.89,60.81 45.08,67.79 IC7.11
  Bottom 0.254: U1.16 85.08,57 91.44,63.35 97.15,63.35 105.41,71.6 116.2,71.6 117.47,70.33 120.01,70.33 121.28,71.6 v123.82,71.6
MA8  (via drill 0.7)
  Top 0.203: 127.63,31.6 126.99,30.96 | 126.99,23.98 127.63,23.34
  Top 0.254: 127.63,31.6 IC3.27 127.63,46.2 123.82,50.01 123.82,60.17 125.09,61.44 IC2.27 v125.09,69.06 125.09,79.22 126.36,80.49 IC6.27 | 126.99,30.96 126.99,23.98 | 127.63,21.44 IC23.27 127.63,23.34 | U1.17 76.83,54.46 75.56,53.19 71.11,53.19 68.57,55.73 64.77,55.73 62.23,58.27 57.78,58.27 56.51,59.54 53.97,59.54 52.7,58.27 47.62,58.27 46.98,57.63 46.98,46.2 46.35,45.57 46.35,43.03 46.98,42.39 46.98,39.22 IC9.18
  Bottom 0.254: U1.17 85.08,54.46 91.44,60.81 97.15,60.81 105.41,69.06 v125.09,69.06
MA9  (via drill 0.7)
  Top 0.203: 128.9,31.6 128.27,30.96 | 128.27,23.98 128.9,23.34
  Top 0.254: 128.9,31.6 IC3.26 128.9,47.47 126.36,50.01 v126.36,57.63 126.36,60.17 127.63,61.44 IC2.26 127.63,79.22 128.9,80.49 IC6.26 | 128.27,30.96 128.27,23.98 | 128.9,21.44 IC23.26 128.9,23.34 | v69.21,49.38 67.94,50.65 63.5,50.65 60.96,53.19 47.62,53.19 47.62,45.57 46.98,44.93 46.98,43.66 47.62,43.03 47.62,36.04 45.72,34.14 IC9.17
  Bottom 0.254: v69.21,49.38 71.11,49.38 72.38,50.65 79.37,50.65 80.64,51.92 U1.18 85.08,51.92 91.44,58.27 97.78,58.27 99.05,57 111.75,57 113.02,58.27 114.93,58.27 115.56,57.63 v126.36,57.63
MA10  (via drill 0.7)
  Top 0.203: 132.71,31.6 132.07,30.96 | 132.07,23.98 132.71,23.34
  Top 0.254: 132.71,31.6 IC3.23 132.71,48.74 133.98,50.01 v133.98,56.36 133.98,60.17 135.25,61.44 IC2.23 135.25,79.22 136.52,80.49 IC6.23 | 132.07,30.96 132.07,23.98 | 132.71,21.44 IC23.23 132.71,23.34 | v62.86,48.11 60.32,50.65 48.26,50.65 48.26,44.93 47.62,44.3 48.26,43.66 48.26,34.14 45.72,31.6 IC9.16
  Bottom 0.254: v62.86,48.11 76.19,48.11 77.46,49.38 U1.19 86.35,49.38 87.62,50.65 92.7,50.65 95.24,53.19 97.15,53.19 99.05,55.09 117.47,55.09 120.01,57 122.55,57 123.19,56.36 v133.98,56.36
MA11  (via drill 0.7)
  Top 0.203: 130.17,31.6 129.53,30.96 | 129.53,23.98 130.17,23.34
  Top 0.254: 130.17,31.6 IC3.25 130.17,48.74 128.9,50.01 v128.9,54.46 128.9,60.17 130.17,61.44 IC2.25 130.17,79.22 131.44,80.49 IC6.25 | 129.53,30.96 129.53,23.98 | 130.17,23.34 IC23.25 | IC1.18 55.88,27.15 53.97,29.06 IC9.15
  Bottom 0.254: v128.9,54.46 121.28,54.46 120.64,55.09 120.01,55.09 118.1,53.82 100.32,53.82 97.15,50.65 94.61,50.65 93.97,50.01 88.89,50.01 85.72,46.84 U1.20 77.46,46.84 76.19,45.57 58.41,45.57 52.07,39.22 52.07,34.14 46.98,29.06 IC9.15
MA12  (via drill 0.7)
  Top 0.203: 125.72,31.6 125.09,30.96 | 125.09,23.98 125.72,23.34
  Top 0.254: 125.09,30.96 125.09,25.88 | 125.72,31.6 125.72,44.3 120.01,50.01 IC2.4 v120.01,53.82 120.01,60.17 121.28,61.44 IC6.4 | 125.09,25.88 IC3.4 | 125.09,25.88 125.09,23.98 | 125.72,23.34 125.72,12.55 125.09,11.91 IC23.4 | IC1.20 55.88,24.61 53.97,26.52 IC9.14
  Bottom 0.254: IC9.14 48.26,26.52 48.89,27.15 48.89,29.69 53.34,34.14 53.34,39.22 59.05,44.93 76.83,44.93 77.46,45.57 83.81,45.57 84.45,44.93 85.72,44.93 90.16,49.38 U1.22 97.15,49.38 100.96,53.19 118.74,53.19 119.38,53.82 v120.01,53.82
MA13  (via drill 0.7)
  Top 0.203: 125.72,23.98 126.36,23.34 | 126.36,31.6 125.72,30.96
  Top 0.254: 126.36,23.34 IC23.28 | 125.72,30.96 125.72,23.98 | 126.36,31.6 IC3.28 126.36,44.93 121.28,50.01 v121.28,55.73 121.28,60.17 122.55,61.44 IC2.28 122.55,79.22 123.82,80.49 IC6.28 | v88.89,46.84 93.97,51.92 U1.23 | IC1.25 59.69,20.8 56.51,20.8 53.34,23.98 IC9.13
  Bottom 0.254: IC9.13 48.26,23.98 49.53,25.25 49.53,29.06 53.97,33.5 53.97,38.58 59.69,44.3 77.46,44.3 78.1,44.93 83.18,44.93 83.81,44.3 86.35,44.3 v88.89,46.84 | U1.23 97.15,51.92 99.69,54.46 117.47,54.46 119.38,55.73 v121.28,55.73
MA14  (via drill 0.7)
  Top 0.203: 124.45,31.6 123.82,30.96
  Top 0.254: IC3.3 123.82,25.88 | 123.82,30.96 IC3.3 | 124.45,31.6 124.45,43.03 117.47,50.01 IC2.3 v117.47,56.36 117.47,60.17 118.74,61.44 v118.74,71.6 | v81.91,43.66 92.07,54.46 U1.24 | IC6.29 121.28,88.11 123.19,86.21 123.19,81.13 121.28,79.22 v121.28,76.68 | IC9.12 45.08,21.44 45.72,22.07 53.97,22.07 56.51,19.53 IC1.24 | IC3.3 123.82,23.98 124.45,23.34 124.45,12.55 123.82,11.91 IC23.3
  Bottom 0.254: IC9.12 46.98,21.44 50.16,24.61 50.16,28.42 54.61,32.87 54.61,37.95 60.32,43.66 v81.91,43.66 | U1.24 97.15,54.46 98.42,55.73 114.93,55.73 115.56,56.36 v117.47,56.36 | v121.28,76.68 120.01,75.41 120.01,72.87 v118.74,71.6
MA15  (via drill 0.7)
  Top 0.203: 122.55,31.6 121.91,30.96 | 121.91,23.98 122.55,23.34
  Top 0.254: 122.55,31.6 IC3.31 122.55,41.12 113.66,50.01 v113.66,57 113.66,60.17 114.93,61.44 IC2.31 114.93,91.29 115.56,91.92 JP3.3 | 121.91,30.96 121.91,23.98 | 122.55,21.44 IC23.31 122.55,23.34 | v83.18,43.03 v91.44,51.92
  Bottom 0.254: IC9.11 45.72,18.9 50.8,23.98 50.8,27.79 55.56,32.55 | 55.56,32.55 55.24,32.87 55.24,37.31 60.96,43.03 80,43.03 80.64,42.39 81.91,42.39 82.55,43.03 v83.18,43.03 | v91.44,51.92 U1.25 97.78,57 98.42,56.36 113.02,56.36 v113.66,57 | IC1.15 60.32,32.23 59.05,30.96 57.15,30.96 55.56,32.55
MA16  (via drill 0.7)
  Top 0.203: 123.19,31.6 122.55,30.96 | 122.55,23.98 123.19,23.34
  Top 0.254: 122.55,30.96 122.55,25.88 | 123.19,31.6 123.19,41.76 114.93,50.01 IC2.2 114.93,60.17 116.2,61.44 v116.2,64.62 IC6.2 | 122.55,25.88 IC3.2 | 122.55,25.88 122.55,23.98 | 123.19,23.34 123.19,12.55 122.55,11.91 IC23.2 | IC10.19 79.37,67.16 80.64,65.89 98.42,65.89 v100.96,63.35
  Bottom 0.254: v100.96,63.35 102.86,65.25 109.85,65.25 110.48,64.62 v116.2,64.62 | IC2.2 114.93,50.01 114.3,49.38 98.42,49.38 97.15,48.11 91.44,48.11 85.08,41.76 78.73,41.76 74.92,37.95 74.92,36.04 IC1.84
MA17  (via drill 0.7)
  Top 0.203: 123.82,31.6 123.19,30.96 | 123.19,23.98 123.82,23.34
  Top 0.254: 123.82,31.6 IC3.30 123.82,42.39 116.2,50.01 116.2,60.17 117.47,61.44 v117.47,62.71 IC2.30 117.47,79.22 118.74,80.49 118.74,86.84 120.01,88.11 120.01,90.65 120.64,91.29 123.19,91.29 125.09,93.19 JP2.3 | 123.19,30.96 123.19,23.98 | 123.82,21.44 IC23.30 123.82,23.34 | IC10.18 79.37,64.62 80.64,63.35 98.42,63.35 v99.69,62.08 | IC1.34 59.69,10.64 40,10.64 IC5.17
  Bottom 0.254: IC5.17 30.47,22.07 32.38,20.17 38.1,20.17 40,22.07 40,34.77 43.18,37.95 45.72,37.95 53.97,46.2 53.97,55.73 56.51,58.27 60.32,58.27 62.86,60.81 67.3,60.81 71.11,64.62 IC10.18 | v99.69,62.08 100.96,62.08 102.23,63.35 107.31,63.35 107.94,62.71 112.39,62.71 113.02,63.35 114.93,63.35 115.56,62.71 v117.47,62.71
MA18  (via drill 0.7)
  Top 0.203: 121.91,31.6 121.28,30.96 | 121.28,23.98 121.91,23.34
  Top 0.254: IC3.1 121.28,25.88 | 121.28,30.96 IC3.1 | v113.66,62.08 113.66,61.44 112.39,60.17 IC2.1 112.39,50.01 121.91,40.49 121.91,31.6 | IC3.1 121.28,23.98 | 121.91,23.34 121.91,18.9 121.28,18.26 121.28,16.36 | 121.28,16.36 IC23.1 | v116.83,20.17 116.83,17.63 118.1,16.36 121.28,16.36 | IC10.17 79.37,62.08 80.64,60.81 v99.05,60.81 | JP1.3 106.04,82.4 108.58,79.86 108.58,69.7 107.31,68.43 107.31,63.35 107.94,62.71 v107.94,61.44 | IC5.16 29.2,19.53 38.73,10.01 54.61,10.01 55.24,9.37 IC1.32
  Bottom 0.254: IC5.16 33.02,19.53 34.92,17.63 38.1,17.63 40.64,20.17 40.64,33.5 42.54,35.41 46.35,35.41 48.26,37.31 48.26,39.22 54.61,45.57 54.61,53.19 57.15,55.73 60.32,55.73 62.86,58.27 67.3,58.27 71.11,62.08 IC10.17 | v99.05,60.81 100.96,60.81 102.86,62.71 106.67,62.71 v107.94,61.44 109.85,61.44 110.48,62.08 v113.66,62.08
MA19
  Top 0.254: IC1.33 53.97,6.83 52.7,5.56 41.91,5.56 30.47,16.99 IC5.15
  Bottom 0.254: IC5.15 38.73,16.99 41.27,19.53 41.27,31.6 42.54,32.87 45.72,32.87 49.53,36.68 49.53,39.22 55.24,44.93 55.24,51.28 57.15,53.19 60.32,53.19 62.86,55.73 67.3,55.73 71.11,59.54 IC10.16
MA20  (via drill 0.7)
  Top 0.254: IC10.15 76.83,57 v77.46,56.36 | v77.46,53.19 77.46,44.3 74.92,41.76 74.92,36.04 IC1.2
  Bottom 0.254: v77.46,53.19 v77.46,56.36
MA21  (via drill 0.7)
  Top 0.254: v57.15,45.57 60.32,43.03 v60.32,40.49
  Bottom 0.254: IC10.14 71.11,54.46 67.3,50.65 62.86,50.65 60.32,48.11 57.78,48.11 57.15,47.47 v57.15,45.57 | v60.32,40.49 56.51,36.68 56.51,34.14 IC1.14
MA22  (via drill 0.7)
  Top 0.254: IC10.13 74.92,51.92 76.19,50.65 76.19,44.3 v73.66,41.76
  Bottom 0.254: IC1.1 v73.66,41.76
MA23  (via drill 0.7)
  Top 0.254: IC10.12 74.29,49.38 75.56,48.11 75.56,44.93 73.66,43.03 73.02,43.03 v71.75,41.76
  Bottom 0.254: v71.75,41.76 72.38,41.12 72.38,36.04 IC1.4
MD0  (via drill 0.7)
  Top 0.203: 137.16,31.6 136.52,30.96 | 136.52,23.98 137.16,23.34
  Top 0.254: IC3.13 136.52,25.88 | 136.52,30.96 IC3.13 | 137.16,31.6 137.16,44.3 142.87,50.01 IC2.13 142.87,60.17 144.14,61.44 IC6.13 144.14,79.22 145.41,80.49 v145.41,84.3 | IC3.13 136.52,23.98 | 137.16,23.34 137.16,12.55 136.52,11.91 IC23.13
  Bottom 0.254: IC8.18 60.32,64.62 62.86,67.16 IC10.2 67.3,67.16 71.11,70.97 85.08,70.97 91.44,77.32 U1.33 97.15,77.32 102.86,83.03 113.66,83.03 114.93,84.3 135.88,84.3 136.52,84.94 139.06,84.94 139.69,84.3 v145.41,84.3 | IC2.13 142.87,50.01 136.52,43.66 114.3,43.66 108.58,37.95 98.42,37.95 92.7,32.23 IC1.72
MD1  (via drill 0.7)
  Top 0.203: 138.42,31.6 137.79,30.96 | 137.79,23.98 138.42,23.34
  Top 0.254: IC3.14 137.79,25.88 | 137.79,30.96 IC3.14 | 138.42,31.6 138.42,43.03 145.41,50.01 IC2.14 145.41,60.17 146.68,61.44 IC6.14 146.68,79.22 147.95,80.49 v147.95,83.03 | IC3.14 137.79,23.98 | 138.42,23.34 138.42,12.55 137.79,11.91 IC23.14
  Bottom 0.254: IC8.17 60.32,62.08 62.86,64.62 IC10.3 67.3,64.62 71.11,68.43 85.08,68.43 91.44,74.78 U1.32 97.15,74.78 104.13,81.76 114.93,81.76 116.2,83.03 135.88,83.03 136.52,82.4 139.06,82.4 139.69,83.03 v147.95,83.03 | IC2.14 145.41,50.01 137.79,42.39 115.56,42.39 108.58,35.41 98.42,35.41 92.7,29.69 IC1.70
MD2  (via drill 0.7)
  Top 0.203: 139.69,31.6 139.06,30.96 | 139.06,23.98 139.69,23.34
  Top 0.254: IC3.15 139.06,25.88 | 139.06,30.96 IC3.15 | 139.69,31.6 139.69,41.76 147.95,50.01 IC2.15 147.95,60.17 149.22,61.44 IC6.15 149.22,79.22 150.49,80.49 v150.49,81.76 | IC3.15 139.06,23.98 | 139.69,23.34 139.69,12.55 139.06,11.91 IC23.15
  Bottom 0.254: IC8.16 60.32,59.54 62.86,62.08 IC10.4 67.3,62.08 71.11,65.89 85.08,65.89 91.44,72.24 U1.31 97.15,72.24 105.41,80.49 116.2,80.49 117.47,81.76 133.34,81.76 134.62,80.49 136.52,80.49 137.79,81.76 v150.49,81.76 | IC2.15 147.95,50.01 139.06,41.12 116.83,41.12 109.85,34.14 99.69,34.14 93.34,27.79 92.07,27.79 91.44,27.15 IC1.68
MD3  (via drill 0.7)
  Top 0.203: 140.33,31.6 139.69,30.96 | 139.69,23.98 140.33,23.34
  Top 0.254: 140.33,31.6 IC3.17 140.33,41.12 149.22,50.01 149.22,60.17 150.49,61.44 IC2.17 v150.49,79.22 151.76,80.49 IC6.17 | 139.69,30.96 139.69,23.98 | 140.33,21.44 IC23.17 140.33,23.34 | v151.76,53.19 151.76,49.38 v151.12,48.74 | v96.52,28.42 96.52,23.98 97.78,22.71 97.78,20.17 97.15,19.53 v90.8,19.53
  Bottom 0.254: IC8.15 60.32,57 62.86,59.54 IC10.5 67.3,59.54 71.11,63.35 85.08,63.35 91.44,69.7 U1.30 97.15,69.7 106.67,79.22 117.47,79.22 118.74,80.49 130.81,80.49 132.07,79.22 v150.49,79.22 | IC2.17 150.49,54.46 v151.76,53.19 | v151.12,48.74 150.49,48.74 141.6,39.85 123.82,39.85 118.1,34.14 113.02,34.14 111.75,32.87 100.96,32.87 v96.52,28.42 | v90.8,19.53 90.8,20.17 90.16,20.8 87.62,20.8 IC1.63
MD4  (via drill 0.7)
  Top 0.203: 139.06,31.6 138.42,30.96 | 138.42,23.98 139.06,23.34
  Top 0.254: 139.06,31.6 IC3.18 139.06,42.39 146.68,50.01 146.68,60.17 147.95,61.44 IC2.18 v147.95,77.32 147.95,79.22 149.22,80.49 IC6.18 | 138.42,30.96 138.42,23.98 | 139.06,21.44 IC23.18 139.06,23.34
  Bottom 0.254: IC8.14 60.32,54.46 62.86,57 IC10.6 67.3,57 71.11,60.81 85.08,60.81 91.44,67.16 U1.29 97.15,67.16 107.94,77.95 118.74,77.95 120.01,79.22 126.36,79.22 128.27,77.32 v147.95,77.32 | IC2.18 147.95,54.46 149.22,53.19 149.22,50.01 139.69,40.49 117.47,40.49 110.48,33.5 100.32,33.5 94.61,27.79 94.61,25.88 93.97,25.25 91.44,25.25 90.8,25.88 87.62,25.88 IC1.67
MD5  (via drill 0.7)
  Top 0.203: 137.79,31.6 137.16,30.96 | 137.16,23.98 137.79,23.34
  Top 0.254: 137.79,31.6 IC3.19 137.79,43.66 144.14,50.01 144.14,60.17 145.41,61.44 IC2.19 v145.41,76.05 145.41,79.22 146.68,80.49 IC6.19 | 137.16,30.96 137.16,23.98 | 137.79,21.44 IC23.19 137.79,23.34
  Bottom 0.254: IC8.13 60.32,51.92 62.86,54.46 IC10.7 67.3,54.46 71.11,58.27 85.08,58.27 91.44,64.62 U1.28 97.15,64.62 109.21,76.68 120.01,76.68 121.28,77.95 123.19,77.95 125.09,76.05 v145.41,76.05 | IC2.19 145.41,54.46 146.68,53.19 146.68,50.01 138.42,41.76 116.2,41.76 109.21,34.77 99.05,34.77 92.7,28.42 87.62,28.42 IC1.69
MD6  (via drill 0.7)
  Top 0.203: 136.52,31.6 135.88,30.96 | 135.88,23.98 136.52,23.34
  Top 0.254: 136.52,31.6 IC3.20 136.52,44.93 141.6,50.01 141.6,60.17 142.87,61.44 IC2.20 v142.87,71.6 142.87,79.22 144.14,80.49 IC6.20 | 135.88,30.96 135.88,23.98 | 136.52,21.44 IC23.20 136.52,23.34
  Bottom 0.254: IC8.12 60.32,49.38 62.86,51.92 IC10.8 67.3,51.92 71.11,55.73 74.92,55.73 76.83,57.63 78.73,57.63 80.64,55.73 85.08,55.73 91.44,62.08 U1.27 97.15,62.08 105.41,70.33 116.2,70.33 116.83,69.7 120.64,69.7 121.28,70.33 125.72,70.33 126.99,71.6 v142.87,71.6 | IC2.20 142.87,54.46 144.14,53.19 144.14,50.01 137.16,43.03 114.93,43.03 107.94,36.04 97.78,36.04 92.7,30.96 87.62,30.96 IC1.71
MD7  (via drill 0.7)
  Top 0.203: 135.25,31.6 134.62,30.96 | 134.62,23.98 135.25,23.34
  Top 0.254: 135.25,31.6 IC3.21 135.25,46.2 139.06,50.01 v139.06,58.27 139.06,60.17 140.33,61.44 IC2.21 140.33,79.22 141.6,80.49 IC6.21 | 134.62,30.96 134.62,23.98 | 135.25,21.44 IC23.21 135.25,23.34
  Bottom 0.254: IC8.11 60.32,46.84 62.86,49.38 IC10.9 67.3,49.38 71.11,53.19 75.56,53.19 77.46,51.28 78.73,51.28 80.64,53.19 85.08,53.19 91.44,59.54 U1.26 99.05,59.54 100.32,58.27 110.48,58.27 111.75,59.54 116.2,59.54 116.83,60.17 120.01,60.17 120.64,59.54 134.62,59.54 135.25,58.9 138.42,58.9 v139.06,58.27 | IC2.21 140.33,54.46 141.6,53.19 141.6,50.01 135.88,44.3 113.66,44.3 109.85,40.49 94.61,40.49 93.97,41.12 90.8,41.12 87.62,37.95 86.99,37.95 IC1.75
N$1
  Top 0.254: U1.36 93.97,84.94 88.89,90.02 U1.3
  Bottom 0.254: R3.1 63.5,84.94 66.67,88.11 77.46,88.11 79.37,90.02 U1.3
N$2
  Bottom 0.254: R7.2 U1.2
N$3  (via drill 0.7)
  Top 0.254: v62.86,11.28 64.13,12.55 78.73,12.55 79.37,13.18 SV1.3
  Bottom 0.254: IC1.30 59.05,11.91 60.32,10.64 62.23,10.64 v62.86,11.28
N$4
  Top 0.254: IC1.59 87.62,15.72 SV1.4
N$5
  Top 0.254: IC1.28 59.05,14.45 60.32,13.18 77.46,13.18 82.55,18.26 SV1.5
N$6
  Top 0.254: IC1.29 77.46,14.45 83.81,20.8 SV1.6
N$7  (via drill 0.7)
  Top 0.254: IC1.76 IC1.74 | IC1.77 83.18,37.31 81.91,36.04 80.64,36.04 80,35.41 80,34.14 79.37,33.5 70.48,33.5 69.84,32.87 67.3,32.87 v66.67,32.23 63.5,29.06 63.5,17.63 v62.86,16.99 | v53.97,13.18 52.07,13.18 R2.1
  Bottom 0.254: IC1.77 IC1.76 | v66.67,32.23 64.77,32.23 63.5,33.5 IC1.10 63.5,34.14 62.86,33.5 59.69,33.5 IC1.12 | v62.86,16.99 61.59,15.72 56.51,15.72 v53.97,13.18
N$8
  Top 0.254: P1.C26 10.16,74.14 8.89,75.41 8.89,78.59 9.52,79.22 P1.C28 12.7,79.22 13.33,78.59 17.14,78.59 17.77,77.95 IC15.6
N$20  (via drill 0.7)
  Top 0.254: R4.1 v15.87,34.14 | IC15.13 31.11,88.11 32.38,89.38 40.64,89.38 40.64,81.76 39.37,80.49 39.37,65.89 | v29.84,33.5 29.84,35.41 31.74,37.31 31.74,42.39 32.38,43.03 v34.29,43.03 | v36.19,48.74 36.19,50.01 39.37,53.19 39.37,65.89 | 39.37,65.89 39.37,65.25
  Bottom 0.254: R4.1 11.43,32.23 10.16,32.23 6.34,28.42 P1.A8 | v15.87,34.14 17.14,34.14 19.04,32.23 27.93,32.23 v29.84,33.5 | v34.29,43.03 34.29,45.57 v36.19,48.74
N$25  (via drill 0.7)
  Top 0.254: P1.C31 v24.76,86.84
  Bottom 0.254: v24.76,86.84 24.76,83.03 27.3,80.49 IC15.10
NC8PHI2  (via drill 0.7)
  Top 0.254: v34.29,75.41 35.55,76.68 38.73,76.68 v38.73,81.76 | v46.98,81.76 v50.8,81.76
  Bottom 0.254: U1.37 89.53,87.48 88.26,86.21 67.3,86.21 62.23,81.13 51.43,81.13 v50.8,81.76 | IC15.8 v34.29,75.41 | v38.73,81.76 v46.98,81.76
PHI2  (via drill 0.7)
  Top 0.254: v55.88,13.18 55.88,13.82 55.24,14.45 49.53,14.45 48.26,13.18 42.54,13.18 41.27,14.45 37.46,14.45 33.02,18.9 33.02,32.23 29.2,32.23 28.57,32.87 28.57,36.04 30.47,37.95 30.47,67.16 v31.11,67.79 | v15.87,68.43 15.87,71.6 18.41,74.14 v18.41,76.68 | V6.7 101.59,13.18 101.59,35.41 104.77,38.58 104.77,42.39 105.41,43.03 105.41,57 104.77,57.63 104.77,69.7 103.5,70.97 103.5,73.51 100.96,76.05 v86.99,76.05 | v41.91,76.68 v49.53,76.68
  Bottom 0.254: IC1.37 64.13,4.93 57.15,4.93 55.24,6.2 55.24,12.55 v55.88,13.18 | v31.11,67.79 16.5,67.79 v15.87,68.43 | v86.99,76.05 85.08,76.05 82.55,78.59 72.38,78.59 69.21,76.05 66.67,76.05 63.5,77.32 53.97,77.32 53.34,76.68 v49.53,76.68 | v41.91,76.68 26.66,76.68 22.86,80.49 IC15.5 19.68,80.49 18.41,79.22 v18.41,76.68
R/-W  (via drill 0.7)
  Top 0.203: 125.09,31.6 124.45,30.96 | 124.45,23.98 125.09,23.34
  Top 0.254: 125.09,31.6 IC3.29 125.09,43.66 118.74,50.01 v118.74,58.9 118.74,60.17 120.01,61.44 IC2.29 120.01,79.22 121.91,81.13 v121.91,85.57 | 124.45,30.96 124.45,23.98 | 125.09,21.44 IC23.29 125.09,23.34 | v116.2,85.57 IC6.31 | v70.48,56.36 71.11,55.73 75.56,55.73 76.19,55.09 79.37,55.09 80,55.73 88.89,55.73 91.44,58.27 v99.05,58.27 | v74.92,11.28 66.03,11.28 64.77,10.01 64.77,6.2 64.13,5.56 53.97,5.56 53.34,4.93 41.27,4.93 31.74,14.45 IC5.14
  Bottom 0.254: IC5.14 30.47,14.45 32.38,16.36 39.37,16.36 41.91,18.9 41.91,29.69 42.54,30.33 46.35,30.33 50.8,34.77 50.8,39.22 55.88,44.3 55.88,49.38 57.15,50.65 60.32,50.65 62.86,53.19 67.3,53.19 v70.48,56.36 | U1.34 98.42,79.86 102.23,83.67 113.02,83.67 114.3,84.94 115.56,84.94 v116.2,85.57 116.83,84.94 121.28,84.94 v121.91,85.57 | v99.05,58.27 99.69,57.63 111.12,57.63 112.39,58.9 v118.74,58.9 | IC1.48 78.73,10.64 78.1,11.28 v74.92,11.28
RA15  (via drill 0.7)
  Top 0.254: IC6.3 118.74,79.22 120.01,80.49 v120.01,86.84
  Bottom 0.254: v120.01,86.84 119.38,87.48 115.56,87.48 114.93,88.11 114.93,90.65 113.02,92.56 JP3.2
RA17
  Top 0.254: IC6.30 118.74,91.29 119.38,91.92 121.28,91.92 122.55,93.19 JP2.2
RA18  (via drill 0.7)
  Top 0.254: v106.67,72.87 106.67,80.49 103.5,83.67 JP1.2
  Bottom 0.254: IC6.1 107.94,74.14 v106.67,72.87
VCC  (via drill 0.7)
  Top 0.254: 120.58,39.28 IC3.32 | IC11.16 IC11.5 | IC11.18 IC11.3 | 100.96,97.64 JP1.1 | 120.64,22.07 IC23.32 | 113.66,12.55 V6.11 109.21,12.55 108.58,13.18 v108.58,17.63 | 116.83,22.07 117.47,22.07 | 55.88,97.64 R6.2 | 59.05,97.64 R5.2 | 62.23,97.64 R3.2 | 38.73,3.02 v38.73,5.56
  Top 0.406: 82.55,3.02 v82.55,5.56 | 3.17,44.93 v6.98,44.93
  Top 0.61: C16.1 26.03,34.77 29.2,37.95 29.2,39.22 IC11.12 29.2,43.03 29.2,44.3 IC11.14 | IC11.7 IC11.14 | IC11.16 29.2,49.38 29.2,48.11 IC11.14 | IC11.18 29.2,58.27 29.2,59.54 IC11.20 28.57,62.71 C23.1 | IC9.20 C11.1 40,47.47 34.92,47.47 34.92,50.01 v35.55,51.28 v35.55,56.36 v35.55,60.17 | IC1.73 87.62,30.96 92.07,30.96 93.34,29.69 | 93.34,29.69 C26.1 91.44,24.61 91.44,23.34 90.16,22.07 IC1.64 87.62,23.34 84.45,23.34 v82.55,21.44 | IC1.38 67.3,8.1 67.3,3.02 | C19.1 27.3,94.46 28.57,93.19 IC15.14 | IC8.20 59.05,70.97 C15.1 | 10.79,91.92 R1.2 | 112.39,29.06 V6.16 | C21.1 68.57,44.3 70.48,46.2 70.48,51.28 68.57,53.19 64.13,53.19 61.59,55.73 57.15,55.73 v54.61,58.27 | 93.34,29.69 97.78,29.69 v98.42,29.06
  Top 0.813: 117.15,38.9 120.58,39.28 | C20.+ R4.2 16.5,17.63 18.41,15.72 22.22,15.72 24.76,18.26 24.76,27.79 26.66,29.69 IC5.20 28.57,30.96 C16.1 | C1.1 120.64,22.07 | 95.24,3.02 SV1.1 | 116.83,22.07 115.56,20.8 115.56,14.45 113.66,12.55 115.56,10.64 115.56,3.02 | 118.74,29.06 112.39,29.06 C8.1 | 26.03,97.64 C19.1 | 41.91,97.64 C18.1 44.45,91.92 IC7.20
  Top 1.016: C1.1 117.47,22.07 117.47,23.34 118.74,24.61 118.74,29.06 v118.74,32.87 118.74,36.04 C13.1 117.15,38.9 110.48,45.57 110.48,60.17 112.39,62.08 IC2.32 112.39,67.79 111.75,68.43 111.75,79.22 113.66,81.13 IC6.32 C9.1 109.85,91.29 110.48,91.92 JP3.1 110.48,97.64 | 120.01,97.64 JP2.1 | QG1.14 QG1.1 146.04,27.15 148.59,29.69 | 148.59,29.69 C4.1 | 157.47,29.69 148.59,29.69 | C25.1 77.46,77.32 76.19,78.59 76.19,84.94 74.29,86.84 74.29,97.64 | IC10.20 73.66,70.97 C27.1
  Top 1.27: 8.25,8.74 3.17,8.74 3.17,44.93 3.17,91.29 10.16,91.29 10.79,91.92
  Top 2.54: P1.C2 P1.C3 | P1.C2 8.25,13.18 8.25,8.74 10.79,6.2 10.79,3.02 38.73,3.02 67.3,3.02 82.55,3.02 95.24,3.02 115.56,3.02 157.47,3.02 157.47,29.69 157.47,97.64 120.01,97.64 110.48,97.64 100.96,97.64 74.29,97.64 62.23,97.64 59.05,97.64 55.88,97.64 41.91,97.64 26.03,97.64 12.06,97.64 10.79,96.37 10.79,91.92 | P1.C2 C20.+
  Bottom 0.254: JP4.3 43.18,8.1 v38.73,5.56 | v108.58,17.63 V6.4
  Bottom 0.406: 59.05,22.07 IC1.22 | IC1.73 87.62,33.5 87.62,36.04 89.53,37.95 C5.1 | v6.98,44.93 17.77,44.93
  Bottom 0.61: IC11.9 18.41,41.12 17.77,41.76 17.77,44.93 17.77,45.57 18.41,46.2 IC11.7 | 59.05,22.07 60.32,20.8 62.23,20.8 | 62.23,20.8 64.13,18.9 64.13,11.28 IC1.38 | IC1.73 IC1.78 81.91,32.87 70.48,32.87 69.84,33.5 | v82.55,5.56 v82.55,21.44 | IC11.16 v35.55,51.28 | v35.55,56.36 IC11.18 | C27.1 69.21,75.41 58.41,75.41 C15.1 | C21.1 69.84,40.49 69.84,33.5 | 69.84,33.5 69.84,30.33 v66.67,30.33 62.86,30.33 62.86,21.44 62.23,20.8 | IC8.20 57.15,69.7 55.88,68.43 55.88,65.25 54.61,63.98 v54.61,58.27 48.26,58.27 46.35,60.17 v35.55,60.17 | C8.1 109.85,30.96 100.32,30.96 v98.42,29.06
  Bottom 0.813: IC1.22 55.24,22.07 C14.1 | IC1.64 90.16,22.07
  Bottom 1.016: IC2.32 C10.1 | U1.8 C25.1 74.29,73.51 C27.1 | v118.74,32.87 v142.87,32.87
  pour Top (isolate 0.813): 157.47,3.02 157.47,31.6 153.03,31.6 153.03,46.84 149.85,46.84 141.6,38.58 141.6,3.02
  pour Top (isolate 0.813): 62.23,10.64 62.23,33.5 84.45,33.5 85.08,32.87 85.08,10.64
XBE  (via drill 0.7)
  Top 0.254: IC1.6 67.3,36.04 60.32,36.04 59.05,37.31 57.15,37.31 50.16,44.3 50.16,44.93 v49.53,45.57 | v45.72,46.2 45.72,63.98 v44.45,65.25 | v53.97,67.16 IC8.19
  Bottom 0.254: v45.72,46.2 v49.53,45.57 | v44.45,65.25 48.26,65.25 48.89,65.89 52.7,65.89 v53.97,67.16
XMA16  (via drill 0.7)
  Top 0.254: v38.73,22.71 41.91,19.53 41.91,17.63 42.54,16.99 42.54,15.72 43.81,14.45 46.98,14.45 48.26,15.72 v76.83,15.72
  Bottom 0.254: IC5.18 31.11,24.61 33.02,22.71 v38.73,22.71 | v76.83,15.72 81.27,11.28 IC1.50

## Text on the board
Top: RA18,15,17 dis<>en | 16MHz | (C) A. Fachat | CSA-CPU816-V2.0C | 1
tPlace: RA18,15,17 dis<>en | 16MHz | (C) A. Fachat | CSA-CPU816-V2.0C | BootROM: | 1 | On | Off